# Altium schematic sheet betterfc.SchDoc: BetterFC
size A3; DrawnBy: Isaak & Maarten; Revision: V0.1; SheetNumber: 1; SheetTotal: 1
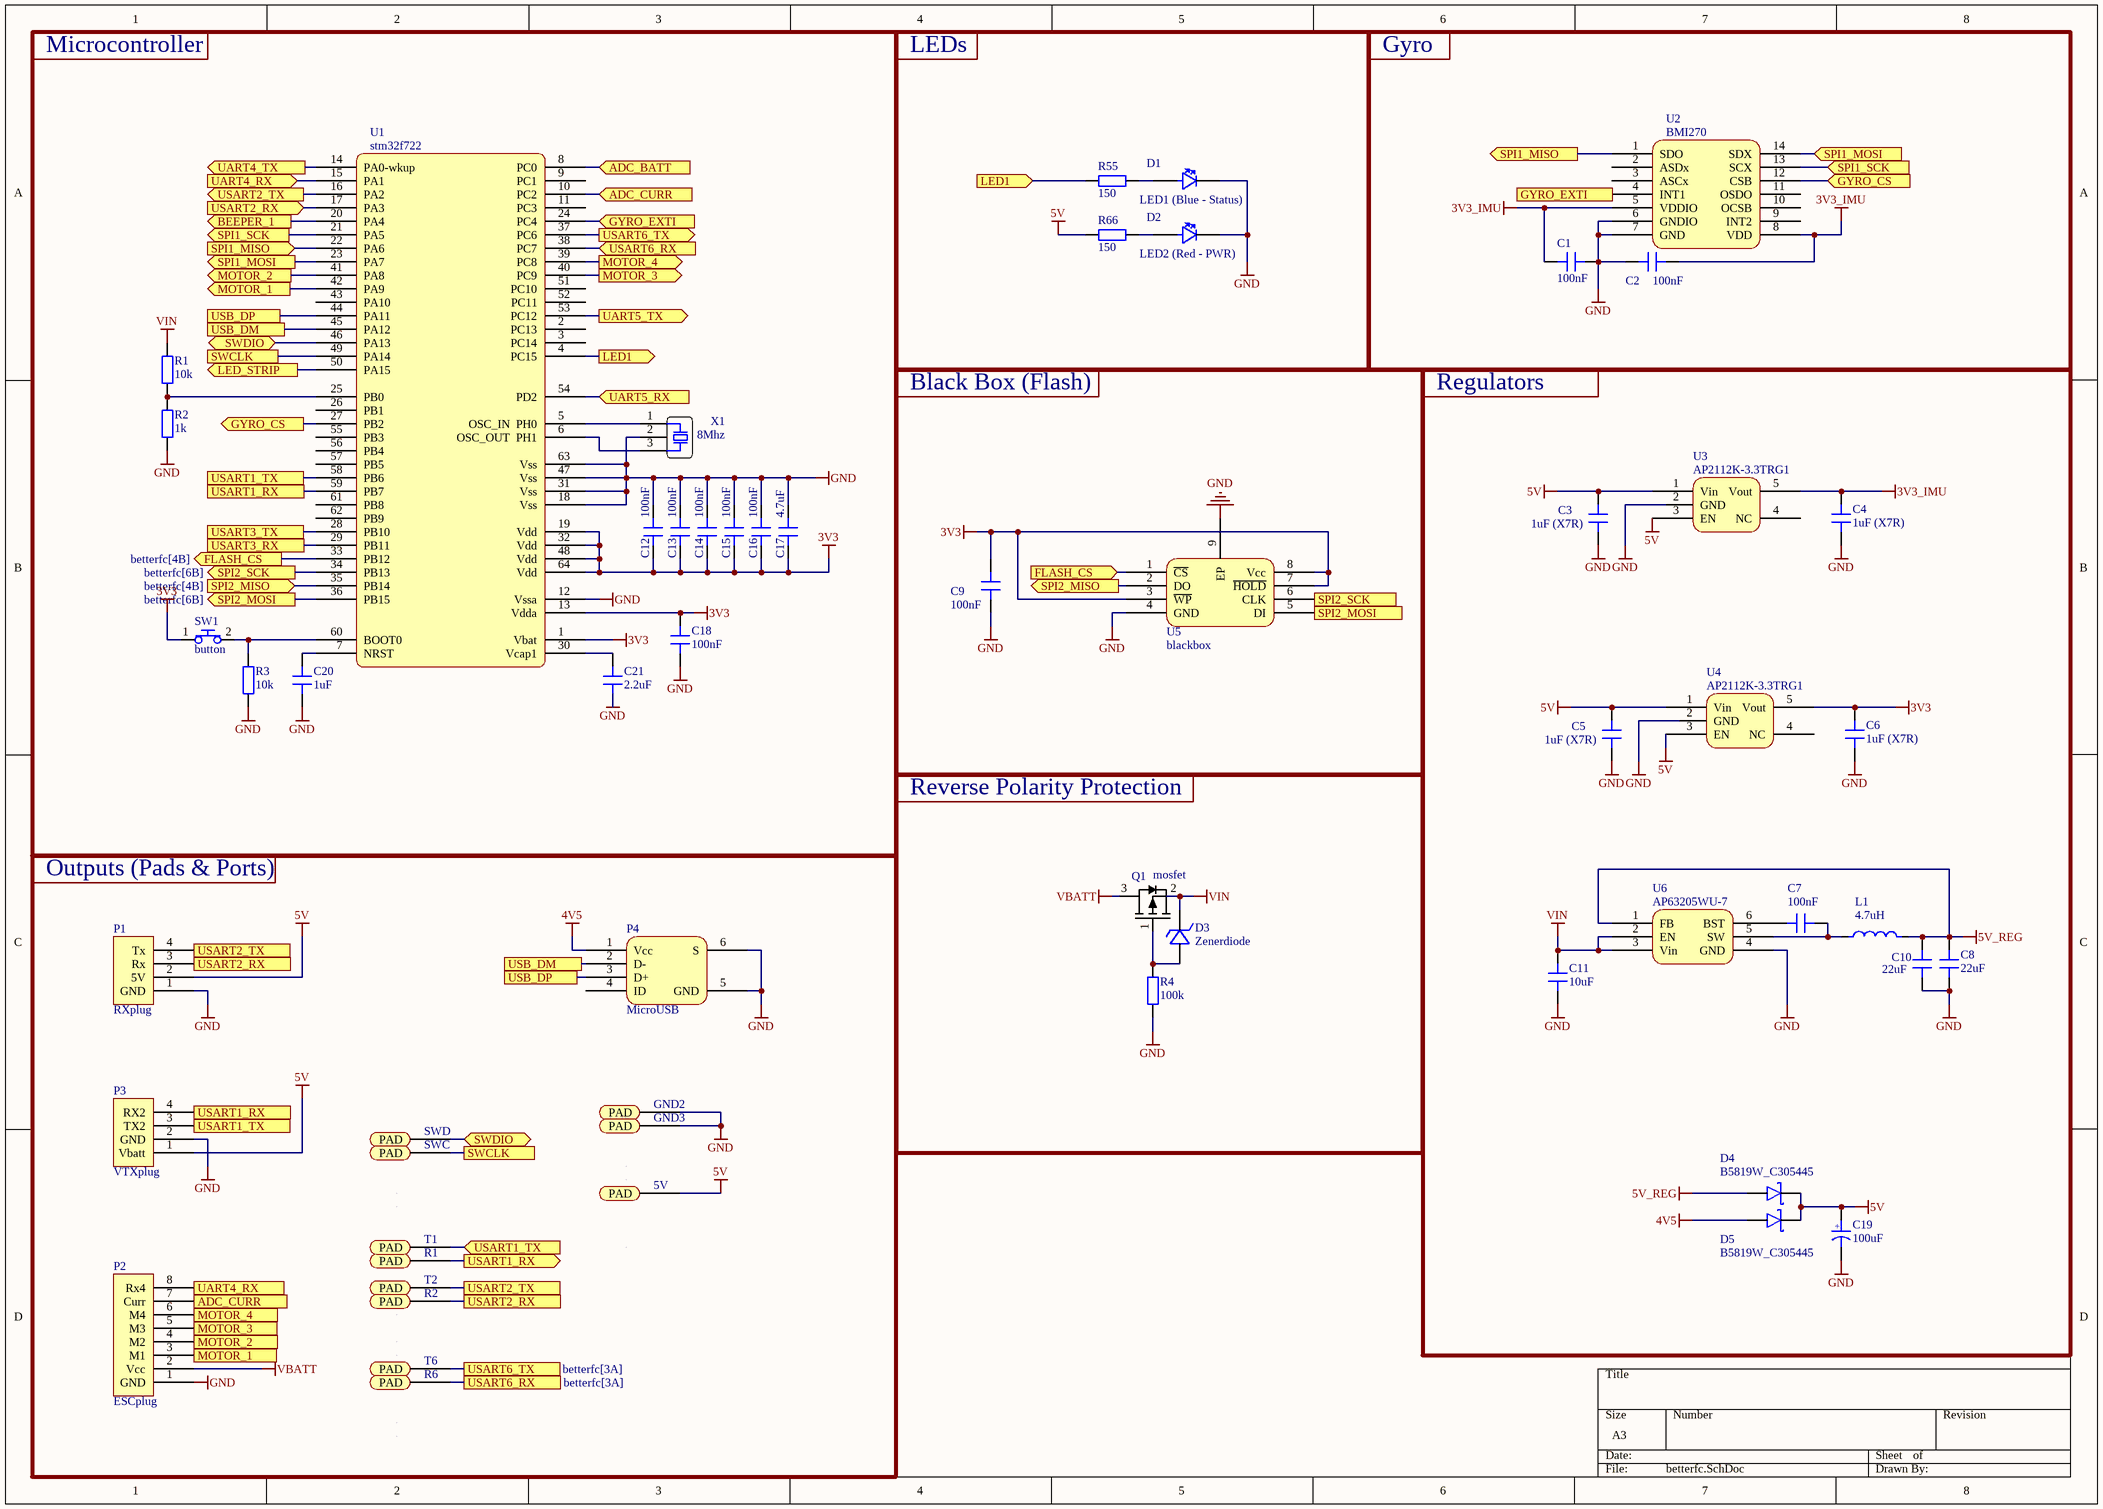
[diagram p0: betterfc.SchDoc]

## Parts
(Parts that share a designator on the sheet are numbered #1, #2 ... from top to bottom, then left to right.)
5V  PAD  [pad]  (value not drawn)
C1  100nF  [0603]
C2  100nF  [0603]
C3  1uF (X7R)  [0603]
C4  1uF (X7R)  [0603]
C5  1uF (X7R)  [0603]
C6  1uF (X7R)  [0603]
C7  100nF  [0603]
C8  22uF  [0603]
C9  100nF  [0603]
C10  22uF  [0603]
C11  10uF  [0603]
C12  100nF  [0603]
C13  100nF  [0603]
C14  100nF  [0603]
C15  100nF  [0603]
C16  100nF  [0603]
C17  4.7uF  [0603]
C18  100nF  [0603]
C19  100uF  [polorizedC - duplicate]
C20  1uF  [0603]
C21  2.2uF  [0603]
D1  LED1 (Blue - Status)  [0603]
D2  LED2 (Red - PWR)  [0603]
D3  Zenerdiode  [Zenerdiode]
D4  B5819W_C305445  [scottydiode]
D5  B5819W_C305445  [scottydiode]
GND2  PAD  [pad]  (value not drawn)
GND3  PAD  [pad]  (value not drawn)
L1  4.7uH  [coil]
P1  RXplug  [RXplug]
P2  ESCplug  [ESCplug]
P3  VTXplug  [VTXplug]
P4  MicroUSB  [microUSB]
Q1  mosfet  [mosfet]
R1#1  10k  [0603]
R1#2  PAD  [pad]  (value not drawn)
R2#1  1k  [0603]
R2#2  PAD  [pad]  (value not drawn)
R3  10k  [0603]
R4  100k  [0603]
R6  PAD  [pad]  (value not drawn)
R55  150  [0603]
R66  150  [0603]
SW1  button  [button]
SWC  PAD  [pad]  (value not drawn)
SWD  PAD  [pad]  (value not drawn)
T1  PAD  [pad]  (value not drawn)
T2  PAD  [pad]  (value not drawn)
T6  PAD  [pad]  (value not drawn)
U1  stm32f722  [STM32F722RET6]
U2  BMI270  [bmi270]
U3  AP2112K-3.3TRG1  [LDO]
U4  AP2112K-3.3TRG1  [LDO]
U5  blackbox  [blackbox]
U6  AP63205WU-7  [AP63205WU-7]
X1  8Mhz  [crystal]

## Blocks framed on the sheet
Microcontroller: C12-C18 C20 C21 R1#1 R2#1 R3 SW1 U1 X1
LEDs: D1 D2 R55 R66
Gyro: C1 C2 U2
Black Box (Flash): C9 U5
Regulators: C3-C8 C10 C11 C19 D4 D5 L1 U3 U4 U6
Reverse Polarity Protection: D3 Q1 R4
Outputs (Pads & Ports): 5V GND2 GND3 P1-P4 R1#2 R2#2 R6 SWC SWD T1 T2 T6

## Ports
ADC_BATT (in), ADC_CURR (in, see betterfc[1D]), ADC_CURR (out, see betterfc[3A]), BEEPER_1 (out), FLASH_CS (in, see betterfc[1B]), FLASH_CS (out, see betterfc[4B]), GYRO_CS (in, see betterfc[1B]), GYRO_CS (out, see betterfc[7A]), GYRO_EXTI (in, see betterfc[6A]), GYRO_EXTI (out, see betterfc[3A]), LED1 (in, see betterfc[3A]), LED1 (out, see betterfc[4A]), LED_STRIP (out), MOTOR_1 (out, see betterfc[1A]), MOTOR_1 (out, see betterfc[1D]), MOTOR_2 (out, see betterfc[1A]), MOTOR_2 (out, see betterfc[1D]), MOTOR_3 (out, see betterfc[1D]), MOTOR_3 (out, see betterfc[3A]), MOTOR_4 (out, see betterfc[1D]), MOTOR_4 (out, see betterfc[3A]), SPI1_MISO (in, see betterfc[6A]), SPI1_MISO (out, see betterfc[1A]), SPI1_MOSI (in, see betterfc[1A]), SPI1_MOSI (out, see betterfc[7A]), SPI1_SCK (in, see betterfc[1A]), SPI1_SCK (out, see betterfc[7A]), SPI2_MISO (in, see betterfc[4B]), SPI2_MISO (out, see betterfc[1B]), SPI2_MOSI (in, see betterfc[1B]), SPI2_MOSI (out, see betterfc[6B]), SPI2_SCK (in, see betterfc[1B]), SPI2_SCK (out, see betterfc[6B]), SWCLK (see betterfc[1A]), SWCLK (see betterfc[2D]), SWDIO (bidir, see betterfc[1A]), SWDIO (bidir, see betterfc[2D]), UART4_RX (in, see betterfc[1D]), UART4_RX (out, see betterfc[1A]), UART4_TX (out), UART5_RX (in), UART5_TX (out), USART1_RX (out, see betterfc[1B], betterfc[1C]), USART1_RX (see betterfc[1B], betterfc[2D]), USART1_RX (see betterfc[1C], betterfc[2D]), USART1_TX (in, see betterfc[1B], betterfc[1C]), USART1_TX (see betterfc[1B], betterfc[2D]), USART1_TX (see betterfc[1C], betterfc[2D]), USART2_RX (in, see betterfc[1C], betterfc[2D]), USART2_RX (see betterfc[1A], betterfc[1C]), USART2_RX (see betterfc[1A], betterfc[2D]), USART2_TX (out, see betterfc[1C], betterfc[2D]), USART2_TX (see betterfc[1A], betterfc[1C]), USART2_TX (see betterfc[1A], betterfc[2D]), USART3_RX, USART3_TX, USART6_RX (in, see betterfc[2D]), USART6_RX (see betterfc[3A]), USART6_TX (out, see betterfc[2D]), USART6_TX (see betterfc[3A]), USB_DM (see betterfc[1A]), USB_DM (see betterfc[2C]), USB_DP (see betterfc[1A]), USB_DP (see betterfc[2C])

## Nets
3V3: C6.2 C9.2 C12.1 C13.1 C14.1 C15.1 C16.1 C17.1 C18.2 SW1.1 U1.1(Vbat) U1.13(Vdda) U1.19(Vdd) U1.32(Vdd) U1.48(Vdd) U1.64(Vdd) U4.5(Vout) U5.3(~{WP}) U5.7(~{HOLD}) U5.8(Vcc)
3V3_IMU: C1.1 C2.2 C4.2 U2.5(VDDIO) U2.8(VDD) U3.5(Vout)
4V5: D5.1 P4.1(Vcc)
5V: 5V.1(PAD) C3.2 C5.2 C19.2 D4.2 D5.2 P1.2(5V) P3.1(Vbatt) R66.1 U3.1(Vin) U3.3(EN) U4.1(Vin) U4.3(EN)
5V_REG: C8.2 C10.2 D4.1 L1.2 U6.1(FB)
GND: C1.2 C2.1 C3.1 C4.1 C5.1 C6.1 C8.1 C9.1 C10.1 C11.1 C12.2 C13.2 C14.2 C15.2 C16.2 C17.2 C18.1 C19.1 C20.1 C21.1 D1.2(+) D2.2(+) GND2.1(PAD) GND3.1(PAD) P1.1(GND) P2.1(GND) P3.2(GND) P4.5(GND) P4.6(S) R2#1.1 R3.1 R4.1 U1.12(Vssa) U1.18(Vss) U1.31(Vss) U1.47(Vss) U1.63(Vss) U2.6(GNDIO) U2.7(GND) U3.2(GND) U4.2(GND) U5.4(GND) U5.9(EP) U6.4(GND) X1.2
VBATT: P2.2(Vcc) Q1.3
VIN: C11.2 D3.2 Q1.2 R1#1.2 U6.2(EN) U6.3(Vin)
ADC_BATT: U1.8(PC0) ; port ADC_BATT
ADC_CURR: P2.7(Curr) U1.10(PC2) ; port ADC_CURR
BEEPER_1: U1.20(PA4) ; port BEEPER_1
FLASH_CS: U1.33(PB12) U5.1(~{CS}) ; port FLASH_CS
GYRO_CS: U1.27(PB2) U2.12(CSB) ; port GYRO_CS
GYRO_EXTI: U1.24(PC4) ; port GYRO_EXTI
LED1: R55.1 U1.4(PC15) ; port LED1
LED_STRIP: U1.50(PA15) ; port LED_STRIP
MOTOR_1: P2.3(M1) U1.42(PA9) ; port MOTOR_1
MOTOR_2: P2.4(M2) U1.41(PA8) ; port MOTOR_2
MOTOR_3: P2.5(M3) U1.40(PC9) ; port MOTOR_3
MOTOR_4: P2.6(M4) U1.39(PC8) ; port MOTOR_4
SPI1_MISO: U1.22(PA6) U2.1(SDO) ; port SPI1_MISO
SPI1_MOSI: U1.23(PA7) U2.14(SDX) ; port SPI1_MOSI
SPI1_SCK: U1.21(PA5) U2.13(SCX) ; port SPI1_SCK
SPI2_MISO: U1.35(PB14) U5.2(DO) ; port SPI2_MISO
SPI2_MOSI: U1.36(PB15) U5.5(DI) ; port SPI2_MOSI
SPI2_SCK: U1.34(PB13) U5.6(CLK) ; port SPI2_SCK
SWCLK: SWC.1(PAD) U1.49(PA14) ; port SWCLK
SWDIO: SWD.1(PAD) U1.46(PA13) ; port SWDIO
UART4_RX: P2.8(Rx4) U1.15(PA1) ; port UART4_RX
UART4_TX: U1.14(PA0-wkup) ; port UART4_TX
UART5_RX: U1.54(PD2) ; port UART5_RX
UART5_TX: U1.53(PC12) ; port UART5_TX
USART1_RX: P3.4(RX2) R1#2.1(PAD) U1.59(PB7) ; port USART1_RX
USART1_TX: P3.3(TX2) T1.1(PAD) U1.58(PB6) ; port USART1_TX
USART2_RX: P1.3(Rx) R2#2.1(PAD) U1.17(PA3) ; port USART2_RX
USART2_TX: P1.4(Tx) T2.1(PAD) U1.16(PA2) ; port USART2_TX
USART3_RX: U1.29(PB11) ; port USART3_RX
USART3_TX: U1.28(PB10) ; port USART3_TX
USART6_RX: R6.1(PAD) U1.38(PC7) ; port USART6_RX
USART6_TX: T6.1(PAD) U1.37(PC6) ; port USART6_TX
USB_DM: P4.2(D-) U1.45(PA12) ; port USB_DM
USB_DP: P4.3(D+) U1.44(PA11) ; port USB_DP
NetC7_1: C7.1 L1.1 U6.5(SW)
NetC7_2: C7.2 U6.6(BST)
NetC20_2: C20.2 U1.7(NRST)
NetC21_2: C21.2 U1.30(Vcap1)
NetD1_1: D1.1 R55.2
NetD2_1: D2.1 R66.2
NetD3_1: D3.1 Q1.1 R4.2
NetR1#1_1: R1#1.1 R2#1.2 U1.25(PB0)
NetR3_2: R3.2 SW1.2 U1.60(BOOT0)
NetU1_5: U1.5(OSC_IN__PH0) X1.1
NetU1_6: U1.6(OSC_OUT__PH1) X1.3

Not connected (* = marked no-connect by the designer): P4 4(ID); U1 2(PC13) 3(PC14) 9(PC1) 11(PC3) 26(PB1) 43(PA10) 51(PC10) 52(PC11) 55(PB3) 56(PB4) 57(PB5) 61(PB8) 62(PB9); U2 2(ASDx) 3(ASCx) 4(INT1) 9(INT2) 10(OCSB) 11(OSDO); U3 4(NC); U4 4(NC)

## Notes on the sheet
- (in symbol polorized C) +

## Library data of the parts
C1-C18 C20 C21 = C
C19 = polorized C
D1 D2 = LED
D4 D5 = ScottyDiode
L1 = coil
R1#1 R2#1 R3 R4 R55 R66 = R
U3 U4 = LDO
X1 = Crystal